# EAGLE design simhid-g1000_left (EAGLE 9.6.2)
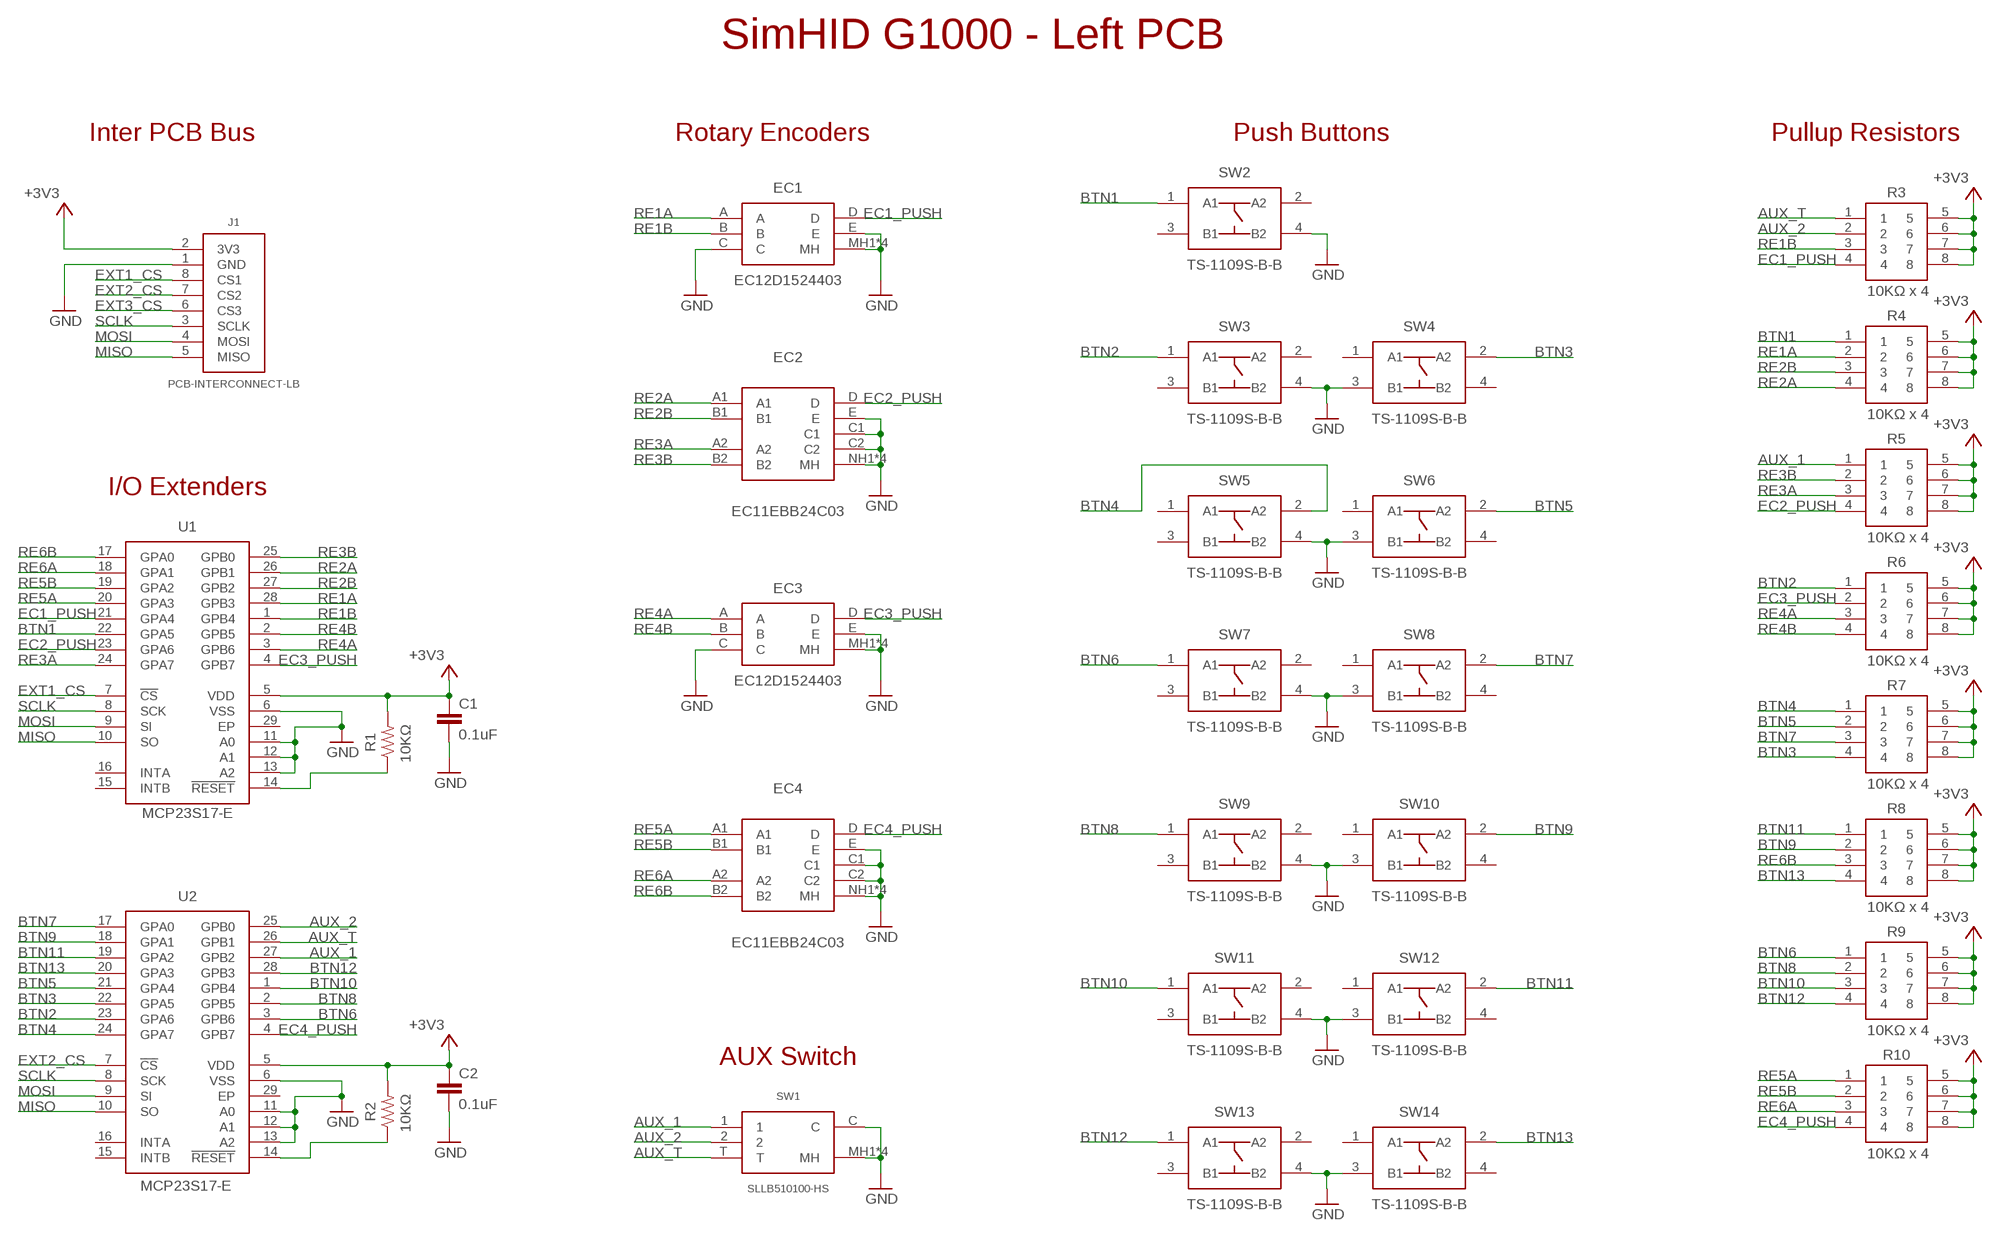
[diagram p0: schematic, sheet 1]

## Parts
C1  0.1uF  RCL_C-EUC0402-HS  [RCL_C0402_HS]
C2  0.1uF  RCL_C-EUC0402-HS  [RCL_C0402_HS]
EC1  EC12D1524403  [EC12D1524403]
EC2  EC11EBB24C03  [EC11EBB24C03]
EC3  EC12D1524403  [EC12D1524403]
EC4  EC11EBB24C03  [EC11EBB24C03]
J1  PCB-INTERCONNECT-LB  [PCB-INTERCONNECT-L]
R1  10KΩ  RCL_R-US_R0402-HS  [RCL_R0402_HS]
R2  10KΩ  RCL_R-US_R0402-HS  [RCL_R0402_HS]
R3  10KΩ x 4  BCN164A102J7  [BCN164A_1]
R4  10KΩ x 4  BCN164A102J7  [BCN164A_1]
R5  10KΩ x 4  BCN164A102J7  [BCN164A_1]
R6  10KΩ x 4  BCN164A102J7  [BCN164A_1]
R7  10KΩ x 4  BCN164A102J7  [BCN164A_1]
R8  10KΩ x 4  BCN164A102J7  [BCN164A_1]
R9  10KΩ x 4  BCN164A102J7  [BCN164A_1]
R10  10KΩ x 4  BCN164A102J7  [BCN164A_1]
SW1  SLLB510100-HS  [SLLB510100-HS]
SW2  TS-1109S-B-B  [TS-1109S-B-B]
SW3  TS-1109S-B-B  [TS-1109S-B-B]
SW4  TS-1109S-B-B  [TS-1109S-B-B]
SW5  TS-1109S-B-B  [TS-1109S-B-B]
SW6  TS-1109S-B-B  [TS-1109S-B-B]
SW7  TS-1109S-B-B  [TS-1109S-B-B]
SW8  TS-1109S-B-B  [TS-1109S-B-B]
SW9  TS-1109S-B-B  [TS-1109S-B-B]
SW10  TS-1109S-B-B  [TS-1109S-B-B]
SW11  TS-1109S-B-B  [TS-1109S-B-B]
SW12  TS-1109S-B-B  [TS-1109S-B-B]
SW13  TS-1109S-B-B  [TS-1109S-B-B]
SW14  TS-1109S-B-B  [TS-1109S-B-B]
U1  MCP23S17-E  MCP23S17-E_ML  [QFN65P600X600X100-29N]
U2  MCP23S17-E  MCP23S17-E_ML  [QFN65P600X600X100-29N]

## Nets
+3V3: C1.1 C2.1 J1.2(3V3) R1.2 R2.2 R3.5 R3.6 R3.7 R3.8 R4.5 R4.6 R4.7 R4.8 R5.5 R5.6 R5.7 R5.8 R6.5 R6.6 R6.7 R6.8 R7.5 R7.6 R7.7 R7.8 R8.5 R8.6 R8.7 R8.8 R9.5 R9.6 R9.7 R9.8 R10.5 R10.6 R10.7 R10.8 U1.5(VDD) U2.5(VDD)
AUX_1: R5.1 SW1.1 U2.27(GPB2)
AUX_2: R3.2 SW1.2 U2.25(GPB0)
AUX_T: R3.1 SW1.T U2.26(GPB1)
BTN1: R4.1 SW2.1(A1) U1.22(GPA5)
BTN2: R6.1 SW3.1(A1) U2.23(GPA6)
BTN3: R7.4 SW4.2(A2) U2.22(GPA5)
BTN4: R7.1 SW5.2(A2) U2.24(GPA7)
BTN5: R7.2 SW6.2(A2) U2.21(GPA4)
BTN6: R9.1 SW7.1(A1) U2.3(GPB6)
BTN7: R7.3 SW8.2(A2) U2.17(GPA0)
BTN8: R9.2 SW9.1(A1) U2.2(GPB5)
BTN9: R8.2 SW10.2(A2) U2.18(GPA1)
BTN10: R9.3 SW11.1(A1) U2.1(GPB4)
BTN11: R8.1 SW12.2(A2) U2.19(GPA2)
BTN12: R9.4 SW13.1(A1) U2.28(GPB3)
BTN13: R8.4 SW14.2(A2) U2.20(GPA3)
EC1_PUSH: EC1.D R3.4 U1.21(GPA4)
EC2_PUSH: EC2.D R5.4 U1.23(GPA6)
EC3_PUSH: EC3.D R6.2 U1.4(GPB7)
EC4_PUSH: EC4.D R10.4 U2.4(GPB7)
EXT1_CS: J1.8(CS1) U1.7(!CS)
EXT2_CS: J1.7(CS2) U2.7(!CS)
EXT3_CS: J1.6(CS3)
GND: C1.2 C2.2 EC1.C EC1.E EC1.MH1(MH) EC1.MH2(MH) EC1.MH3(MH) EC1.MH4(MH) EC2.C1 EC2.C2 EC2.E EC2.NH1(MH) EC2.NH2(MH) EC2.NH3(MH) EC2.NH4(MH) EC3.C EC3.E EC3.MH1(MH) EC3.MH2(MH) EC3.MH3(MH) EC3.MH4(MH) EC4.C1 EC4.C2 EC4.E EC4.NH1(MH) EC4.NH2(MH) EC4.NH3(MH) EC4.NH4(MH) J1.1(GND) SW1.C SW1.MH1(MH) SW1.MH2(MH) SW1.MH3(MH) SW1.MH4(MH) SW2.4(B2) SW3.4(B2) SW4.3(B1) SW5.4(B2) SW6.3(B1) SW7.4(B2) SW8.3(B1) SW9.4(B2) SW10.3(B1) SW11.4(B2) SW12.3(B1) SW13.4(B2) SW14.3(B1) U1.6(VSS) U1.11(A0) U1.12(A1) U1.13(A2) U2.6(VSS) U2.11(A0) U2.12(A1) U2.13(A2)
MISO: J1.5(MISO) U1.10(SO) U2.10(SO)
MOSI: J1.4(MOSI) U1.9(SI) U2.9(SI)
N$3: R1.1 U1.14(!RESET)
N$19: R2.1 U2.14(!RESET)
RE1A: EC1.A R4.2 U1.28(GPB3)
RE1B: EC1.B R3.3 U1.1(GPB4)
RE2A: EC2.A1 R4.4 U1.26(GPB1)
RE2B: EC2.B1 R4.3 U1.27(GPB2)
RE3A: EC2.A2 R5.3 U1.24(GPA7)
RE3B: EC2.B2 R5.2 U1.25(GPB0)
RE4A: EC3.A R6.3 U1.3(GPB6)
RE4B: EC3.B R6.4 U1.2(GPB5)
RE5A: EC4.A1 R10.1 U1.20(GPA3)
RE5B: EC4.B1 R10.2 U1.19(GPA2)
RE6A: EC4.A2 R10.3 U1.18(GPA1)
RE6B: EC4.B2 R8.3 U1.17(GPA0)
SCLK: J1.3(SCLK) U1.8(SCK) U2.8(SCK)
Unconnected: SW2.2(A2) SW2.3(B1) SW3.2(A2) SW3.3(B1) SW4.1(A1) SW4.4(B2) SW5.1(A1) SW5.3(B1) SW6.1(A1) SW6.4(B2) SW7.2(A2) SW7.3(B1) SW8.1(A1) SW8.4(B2) SW9.2(A2) SW9.3(B1) SW10.1(A1) SW10.4(B2) SW11.2(A2) SW11.3(B1) SW12.1(A1) SW12.4(B2) SW13.2(A2) SW13.3(B1) SW14.1(A1) SW14.4(B2) U1.15(INTB) U1.16(INTA) U1.29(EP) U2.15(INTB) U2.16(INTA) U2.29(EP)

## Notes on the sheet
- SimHID G1000 - Left PCB
- Inter PCB Bus | Rotary Encoders | Push Buttons | Pullup Resistors
- I/O Extenders
- AUX Switch

## Library data of the parts
C1 C2 = gen-discrete3:RCL_C-EU: CAPACITOR, European symbol
EC1 EC3 = RotaryEncoder:EC12D1524403
EC2 EC4 = RotaryEncoder:EC11EBB24C03
J1 = SimHID-G1000:PCB-INTERCONNECT
R1 R2 = gen-discrete3:RCL_R-US_: RESISTOR, American symbol
R3-R10 = BCN164A102J7:BCN164A102J7: BI TECHNOLOGIES / TT ELECTRONICS - BCN164A102J7 - RESISTOR, RESISTOR ARRAY, 4, 1KOHM, 5%, 1206 Source: Datasheet <http://www.farnell.com/datasheets/2158867.pdf>; ARROW_PART_NUMBER: BCN164A102J7; DESCRIPTION: BI TECHNOLOGIES / TT ELECTRONICS - BCN164A102J7 - RESISTOR, RESISTOR ARRAY, 4, 1KOHM, 5%, 1206; HEIGHT: mm; MANUFACTURER_NAME: BI Technologies; MANUFACTURER_PART_NUMBER: BCN164A102J7
SW1 = Switches:SLLB510100
SW2-SW14 = Switches:TS-1109S-B-B
U1 U2 = MCP23S17-E_ML:MCP23S17-E_ML: 16-Bit I/O Port Expander SPI 10M QFN28EP Microchip MCP23S17-E/ML, 16-channel 16bit I/O Expander 10MHz, Serial-SPI, 28-Pin QFN Source: Datasheet <http://docs-emea.rs-online.com/webdocs/1169/0900766b811692f9.pdf>; ARROW_PART_NUMBER: MCP23S17-E/ML; ARROW_PRICE-STOCK: https://www.arrow.com/en/products/mcp23s17-eml/microchip-technology; DESCRIPTION: 16-Bit I/O Port Expander SPI 10M QFN28EP Microchip MCP23S17-E/ML, 16-channel 16bit I/O Expander 10MHz, Serial-SPI, 28-Pin QFN; HEIGHT: 1mm; MANUFACTURER_NAME: Microchip; MANUFACTURER_PART_NUMBER: MCP23S17-E/ML; MOUSER_PART_NUMBER: 579-MCP23S17-E/ML; MOUSER_PRICE-STOCK: https://www.mouser.co.uk/ProductDetail/Microchip-Technology/MCP23S17-E-ML/?qs=usxtMOJb1RyqBjk32jXtPQ%3D%3D

## Board
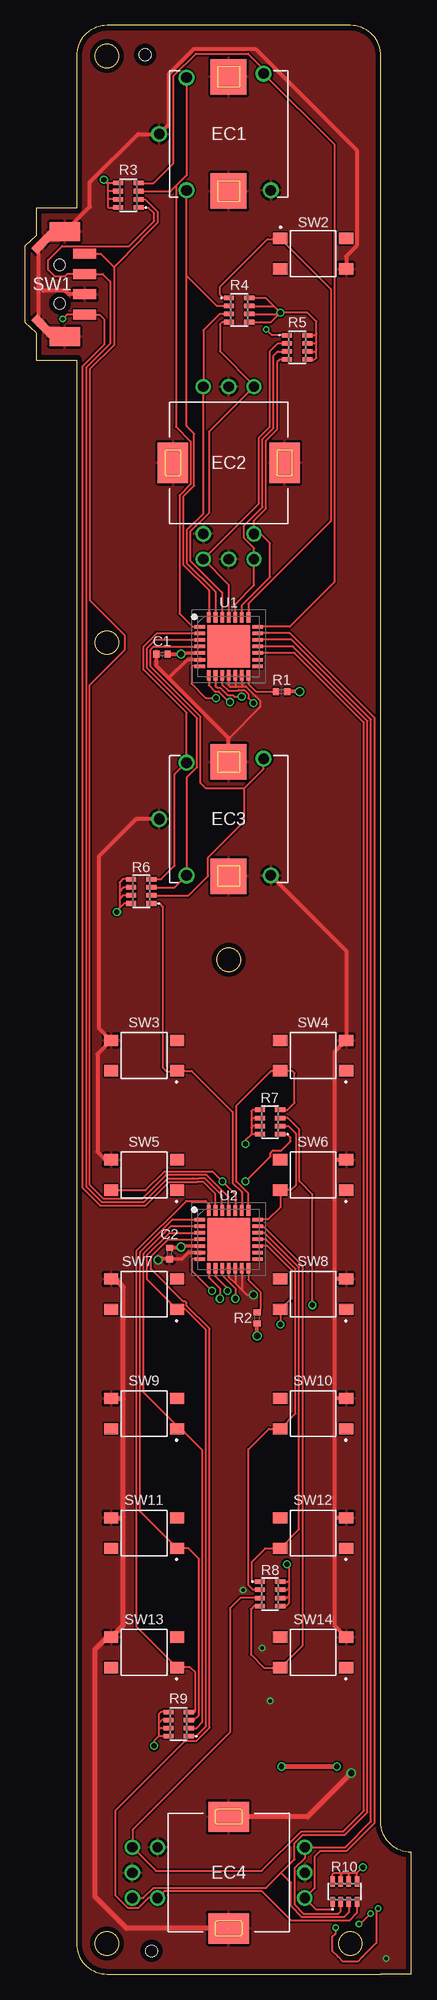
[diagram p1: board, top side]
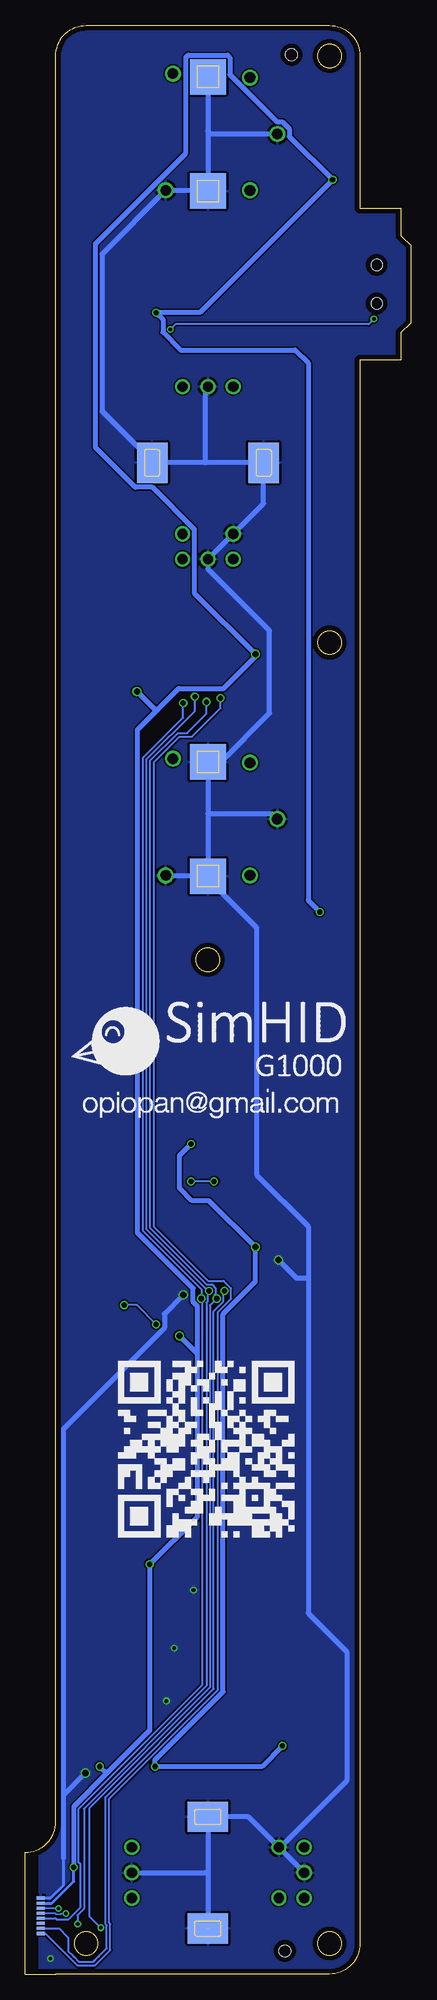
[diagram p2: board, bottom side, seen from below]

Size 38.05 x 192 mm. Coordinates in mm from the lower left corner, seen from the top.
Outline: 35.05,0 8.05,0 arc-90 5.05,3 5.05,159 1.05,159 1.05,161.7 0,162.7 0,170.3 1.05,171.3 1.05,174 5.05,174 5.05,189 arc-90 8.05,192 32.05,192 arc-90 35.05,189 35.05,15
Outline: 38.05,0 38.05,12
Outline: circle at 8.05,3 radius 1.15
Outline: circle at 8.05,131.19 radius 1.15
Outline: circle at 20.05,99.94 radius 1.15
Outline: circle at 32.05,3 radius 1.15
Outline: circle at 8.05,189 radius 1.15
Copper layers (1*16): Top 0.035mm / dielectric 1mm / Bottom 0.035mm
Design rules "Elecrow_2-layer_PCB_eagle_rule *": minimum track width 6mil, minimum drill 12mil, track to track 6mil, track to pad 6mil, pad to pad 6mil, via to via 8mil, smd to smd 0mil, copper to edge 20mil, drill to drill 10mil, minimum pad ring 6mil, minimum via ring 6mil, stop-mask expansion 0mil, vias tented up to drill 100mil, thermal gap 10mil
Holes 2.3 mm at 8.05,189 8.05,131.19 20.05,99.94 8.05,3 32.05,3
Holes 1.15 mm at 11.81,189.1 12.45,2.29

### Footprints (pad centres in the part's own frame; a part is rotated, then mirrored left to right if it is on the bottom)
RCL_C0402_HS = smd 0.6 x 0.7: 1 -0.55,0; 2 0.55,0
EC12D1524403 = drill 1.05: A 5.55,-4.15; B -5.55,-4.15; C 5.55,4.15; D -5.95,3.45; E 0,-6.85 | smd 3.5 x 3.55: MH1 -5.625,0; MH3 5.625,0 | smd 3.5 x 3.55 bottom: MH2 -5.625,0; MH4 5.625,0
EC11EBB24C03 = drill 1: A1 2.5,7.5; A2 2.5,-9.5; B1 -2.5,7.5; B2 -2.5,-9.5; C1 0,7.5; C2 0,-9.5; D 2.5,-7; E -2.5,-7 | smd 3 x 4: NH1 5.5,0; NH3 -5.5,0 | smd 3 x 4 bottom: NH2 5.5,0; NH4 -5.5,0
PCB-INTERCONNECT-L = smd 0.8 x 0.3: 1 -1.5,7.5; 2 -1.5,7; 3 -1.5,6.5; 4 -1.5,6; 5 -1.5,5.5; 6 -1.5,5; 7 -1.5,4.5; 8 -1.5,4
RCL_R0402_HS = smd 0.6 x 0.7: 1 -0.55,0; 2 0.55,0
BCN164A_1 = smd 0.45 x 1: 1 -1.2,-1; 2 -0.4,-1; 3 0.4,-1; 4 1.2,-1; 5 -1.2,1; 6 -0.4,1; 7 0.4,1; 8 1.2,1
SLLB510100-HS = smd 1 x 2.3: 1 -3,-1.45; 2 3,-1.45; C -1,-1.45; T 1,-1.45 | smd 2.6 x 0.8 rotated 45: MH1 -4.172,2.616 | smd 2.6 x 0.8 rotated 315: MH2 4.172,2.616 | smd 1.85 x 3: MH3 -5.175,0.5; MH4 5.175,0.5 | hole 1.1: 1.9,1; -1.9,1
TS-1109S-B-B = smd 1.4 x 1.1: 1 -3.25,1.5; 2 3.25,1.5; 3 -3.25,-1.5; 4 3.25,-1.5
QFN65P600X600X100-29N = smd 1.05 x 0.35: 1 -2.85,1.95; 2 -2.85,1.3; 3 -2.85,0.65; 4 -2.85,0; 5 -2.85,-0.65; 6 -2.85,-1.3; 7 -2.85,-1.95; 15 2.85,-1.95; 16 2.85,-1.3; 17 2.85,-0.65; 18 2.85,0; 19 2.85,0.65; 20 2.85,1.3; 21 2.85,1.95 | smd 0.35 x 1.05: 8 -1.95,-2.85; 9 -1.3,-2.85; 10 -0.65,-2.85; 11 0,-2.85; 12 0.65,-2.85; 13 1.3,-2.85; 14 1.95,-2.85; 22 1.95,2.85; 23 1.3,2.85; 24 0.65,2.85; 25 0,2.85; 26 -0.65,2.85; 27 -1.3,2.85; 28 -1.95,2.85 | smd 4.2 x 4.2: 29 0,0

### Placement (x,y rotation side)
C1  13.46,130.05 180 top
C2  14.22,70.99 270 top
EC1  20.05,181.3 270 top
EC2  20.05,148.9 0 top
EC3  20.05,113.8 270 top
EC4  20.05,10 270 top
J1  35.05,0 0 bottom
R1  25.27,126.36 0 top
R2  22.86,64.64 270 top
R3  10.16,175.26 90 top
R4  21.08,163.96 270 top
R5  26.8,160.27 270 top
R6  11.43,106.68 90 top
R7  24.13,83.95 90 top
R8  24.13,37.47 270 top
R9  15.11,24.64 90 top
R10  31.5,8.13 0 top
SW1  4.4,166.5 90 top
SW2  28.38,169.5 0 top
SW3  11.72,90.5 180 top
SW4  28.38,90.5 180 top
SW5  11.72,78.74 180 top
SW6  28.38,78.74 180 top
SW7  11.72,66.98 180 top
SW8  28.38,66.98 180 top
SW9  11.72,55.22 180 top
SW10  28.38,55.22 180 top
SW11  11.72,43.46 180 top
SW12  28.38,43.46 180 top
SW13  11.72,31.7 180 top
SW14  28.38,31.7 180 top
U1  20.05,130.81 0 top
U2  20.05,72.39 0 top
U$1  [SIMHID-G1000-LOGO]  33.6,83 0 bottom
U$2  [SHIMHID-G1000-QRCODE]  31.3,40.64 0 bottom

### Tracks (layer width: path | path; a pad name or v marks a point on that pad's centre or on a via)
+3V3  (via drill 0.5, 0.6)
  Top 0.2: R3.8 8.07,176.46 | 8.07,176.46 v7.75,176.78 | 8.07,176.46 8.13,176.4 8.13,175.64 | 8.13,175.64 8.13,174.88 | 8.13,174.88 8.13,174.12 8.19,174.06 R3.5 | R3.6 8.15,174.86 8.13,174.88 | R3.7 8.15,175.66 8.13,175.64 | R4.5 23.69,165.16 24.49,164.36 | 24.49,164.36 v25.15,163.7 | R4.6 24.49,164.36 | R4.7 25,163.56 v25.15,163.7 | R4.8 24.2,162.76 v25.15,163.7 | R5.5 28.5,161.47 28.7,161.67 | 28.7,161.67 28.7,162.81 27.81,163.7 v25.15,163.7 | R5.6 28.59,160.67 28.7,160.78 | 28.7,160.78 28.7,161.67 | R5.7 28.56,159.87 28.7,160.02 | 28.7,160.02 28.7,160.78 | R5.8 28.52,159.07 28.7,159.26 28.7,160.02 | R6.5 9.72,105.48 9.27,105.03 | v9.02,104.65 9.02,104.78 9.27,105.03 | R6.6 9.67,106.28 9.65,106.3 9.27,105.92 | 9.27,105.92 9.27,105.03 | R6.7 10.41,107.06 9.65,107.06 9.27,106.68 | 9.27,106.68 9.27,105.92 | R6.8 9.58,107.88 9.27,107.57 9.27,106.68 | R10.8 32.7,9.96 | 32.7,9.96 v33.27,10.54 | R10.7 31.9,9.8 32.06,9.96 | 32.06,9.96 32.7,9.96 | R10.6 31.1,9.76 31.3,9.96 | 31.3,9.96 32.06,9.96 | R10.5 30.3,9.85 30.41,9.96 31.3,9.96 | R7.5 22.3,82.75 | v21.72,81.79 21.72,82.17 22.3,82.75 | R7.6 22.46,83.55 22.3,83.38 | 22.3,83.38 22.3,82.75 | R7.7 22.5,84.35 22.3,84.14 | 22.3,84.14 22.3,83.38 | R7.8 22.41,85.15 22.3,85.03 22.3,84.14 | R8.5 25.84,38.66 26.04,38.86 | v25.78,40.39 26.04,40.13 26.04,38.86 | R8.6 25.8,37.87 26.04,38.1 | 26.04,38.1 26.04,38.86 | R8.7 25.76,37.06 26.04,37.34 | 26.04,37.34 26.04,38.1 | R8.8 25.72,36.27 26.04,36.58 26.04,37.34 | R9.5 13.15,23.44 | v12.7,22.48 12.7,22.99 13.15,23.44 | R9.6 13.35,24.24 13.34,24.26 13.15,24.07 | 13.15,24.07 13.15,23.44 | R9.7 13.48,25.04 13.15,24.71 | 13.15,24.71 13.15,24.07 | R9.8 13.39,25.84 13.15,25.6 13.15,24.71
  Top 0.35: U1.5 15.48,130.16 v15.37,130.05 | U2.5 15.48,71.74 v15.37,71.63
  Top 0.4: C1.1 v15.37,130.05 | v27.05,126.36 R1.2 | v15.37,71.63 15.28,71.54 C2.1 | v22.86,62.87 R2.2
  Top 0.5: v30.73,20.45 v25.27,20.45
  Bottom 0.3: J1.2 36.53,6.99 35.44,6.99 33.27,9.15 v33.27,10.54
  Bottom 0.5: v33.27,10.54 33.27,16.51 29.97,19.81 | 25.27,124.33 26.99,122.61 26.99,73.04 21.51,67.56 21.51,66.22 21.09,65.8 21.09,61.1 | 25.27,124.33 22.94,126.66 18.5,126.66 15.37,129.79 v15.37,130.05 21.4,136.08 21.4,142.38 25.52,146.5 27.22,146.5 31.13,150.41 31.13,170.5 22.23,179.41 22.23,188.84 21.99,189.08 18.11,189.08 17.87,188.84 17.87,187.14 13.22,182.49 12.71,182.49 12.01,181.79 12.01,181.05 v7.75,176.78 20.83,163.7 v25.15,163.7 24.48,163.04 24.48,161.75 22.75,160.02 11.43,160.02 10.16,158.75 10.16,105.79 v9.02,104.65 | v21.72,81.79 22.86,80.64 22.86,77.47 21.59,76.2 19.94,76.2 v15.37,71.63 15.37,68.22 18.55,65.04 18.55,27.82 25.27,21.1 v25.27,20.45 14.73,20.45 v12.7,22.48 | 21.09,61.1 21.09,45.07 v25.78,40.39 25.78,24 29.97,19.81 | v27.05,126.36 25.27,124.58 25.27,124.33 | v22.86,62.87 21.09,61.1 | v30.73,20.45 30.1,19.81 29.97,19.81
AUX_1  (via drill 0.35)
  Top 0.2: v3.68,163.07 4.12,163.5 SW1.1 7.32,163.5 7.75,163.07 7.75,160.53 5.66,158.44 5.66,77.44 7.37,75.73 11.85,75.73 14.16,78.04 16.51,78.04 16.95,78.04 17.57,78.04 18.75,76.86 U2.27 | R5.1 24.33,161.47 v23.75,162.05
  Bottom 0.2: v3.68,163.07 4.19,162.56 23.24,162.56 v23.75,162.05
AUX_2
  Top 0.2: SW1.2 7.41,169.5 8.73,168.18 | 8.73,168.18 8.73,160.51 6.36,158.14 6.36,135.37 9.81,131.92 9.81,130.47 6.36,127.02 6.36,77.74 7.66,76.44 11.56,76.44 13.87,78.75 17.86,78.75 20.05,76.56 U2.25 | 8.73,168.18 11.43,170.87 11.43,170.95 13.05,172.57 13.05,173.63 11.82,174.86 R3.2
AUX_T
  Top 0.2: R3.1 12.12,174.06 12.7,173.48 12.7,172.72 10.23,170.25 3.62,170.25 2.24,168.88 2.24,167.92 2.92,167.24 3.88,167.24 4.14,167.5 SW1.T 7.63,167.5 8.38,166.75 8.38,160.66 6.01,158.28 6.01,77.59 7.52,76.08 11.71,76.08 14.02,78.39 16.51,78.39 17.1,78.39 17.72,78.39 19.4,76.71 U2.26
BTN1
  Top 0.2: SW2.1 25.19,170.94 | 25.19,170.94 30.13,166 30.13,143.16 22,135.03 U1.22 | 25.19,170.94 23.88,170.94 19.18,166.24 19.18,165.48 19.5,165.16 R4.1
BTN2
  Top 0.2: R6.1 13.27,105.48 13.59,105.16 13.59,89.28 13.97,88.9 14.87,88.9 SW3.1 16.41,89 20.45,84.96 20.45,77.95 21.35,77.05 U2.23
BTN3
  Top 0.2: R7.4 25.84,85.15 26.54,85.85 26.54,88.77 26.32,89 SW4.2 24.23,89 20.8,85.57 20.8,78.1 22,76.9 U2.22
BTN4  (via drill 0.5)
  Top 0.2: v21.72,78.11 24.18,80.57 24.18,80.89 24.44,81.15 25.27,81.15 26.16,82.04 26.16,82.42 25.84,82.75 R7.1 | U2.24 20.7,76.84 19.56,77.98 v19.43,78.11 18.44,79.1 13.72,79.1 11.87,77.24 SW5.2
  Bottom 0.2: v19.43,78.11 v21.72,78.11
BTN5
  Top 0.2: R7.2 25.93,83.55 26.67,82.8 26.67,77.72 26.19,77.24 SW6.2 25.13,75.55 23.92,74.34 U2.21
BTN6
  Top 0.2: R9.1 16.17,23.5 16.89,23.5 17.82,24.43 17.82,63.46 15.8,65.48 SW7.1 12.02,68.42 12.02,70.85 14.22,73.04 U2.3
BTN7  (via drill 0.5)
  Top 0.2: v28.32,65.91 28.32,76.83 27.02,78.13 27.02,83.21 25.89,84.35 R7.3 | SW8.2 25.15,65.47 | 25.15,65.47 v25.15,64.01 | 25.15,65.47 26.29,66.61 26.29,69.34 23.89,71.74 U2.17
  Bottom 0.2: v25.15,64.01 27.05,65.91 v28.32,65.91
BTN8
  Top 0.152: SW9.1
  Top 0.2: R9.2 16.87,24.24 17.47,24.84 17.47,51.62 15.37,53.72 15.24,53.72 | 15.24,53.72 SW9.1 | U2.2 14.37,73.69 11.67,70.99 11.67,57.29 15.24,53.72
BTN9
  Top 0.2: R8.2 22.46,37.87 22,38.33 22,51.72 24,53.72 SW10.2 26.64,55.23 26.64,69.49 23.74,72.39 U2.18
BTN10
  Top 0.2: R9.3 16.66,25.04 17.12,25.5 17.12,40.92 16.08,41.96 SW11.1 11.32,45.61 11.32,71.14 14.52,74.34 U2.1
BTN11
  Top 0.2: R8.1 22.42,38.66 22.35,38.73 22.35,40.64 23.67,41.96 SW12.2 26.99,43.82 26.99,69.63 23.59,73.04 U2.19
BTN12
  Top 0.152: 14.97,30.23 SW13.1
  Top 0.2: R9.4 16.69,25.84 16.76,25.91 16.76,29.72 16.26,30.23 14.97,30.23 10.97,34.23 10.97,71.29 15.88,76.2 17.78,76.2 18.1,75.88 U2.28
BTN13
  Top 0.2: R8.4 22.55,36.27 22.23,35.94 22.23,31.5 23.52,30.2 SW14.2 27.35,32.41 27.35,69.78 23.44,73.69 U2.20
EC1_PUSH
  Top 0.2: R3.4 12.63,176.46 14.61,178.44 14.61,187.03 16.81,189.23 21.97,189.23 23.5,187.7 EC1.D 30.48,180.27 30.48,137.16 26.08,132.76 U1.21
EC2_PUSH
  Top 0.2: R5.4 25.09,159.07 24.82,158.81 24.82,152.18 23.75,151.1 23.75,144.4 22.55,143.2 EC2.D 23.2,141.9 24.13,140.97 24.13,137.66 21.35,134.88 U1.23
EC3_PUSH
  Top 0.2: 21.59,116.84 17.78,116.84 17.29,117.33 17.29,123.89 12.36,128.82 12.36,130.5 12.67,130.81 U1.4 | EC3.D 23.5,118.75 21.59,116.84 | R6.2 16.11,106.28 18.02,108.19 18.02,110.03 21.59,113.6 21.59,116.84
EC4_PUSH
  Top 0.2: R10.4 32.7,6.03 31.93,5.26 26.23,5.26 23.35,8.15 13.7,8.15 EC4.D 12.13,7.5 11.13,6.5 10.13,6.5 8.89,7.74 8.89,16.13 15.72,22.96 16.86,22.96 18.17,24.28 18.17,63.6 15.92,65.86 15.92,66.14 15.77,66.28 15.56,66.28 12.38,69.46 12.38,70.7 14.06,72.39 U2.4
EXT1_CS  (via drill 0.5)
  Top 0.2: U1.7 16.46,128.86 16.38,128.78 16.38,127.13 17.78,125.73 v18.8,125.73
  Bottom 0.2: v18.8,125.73 18.8,124.71 21.59,121.92 22.86,121.92 25.4,119.38 25.4,73.66 20.06,68.32 18.5,68.32 17.76,67.58 17.76,66.54 19.05,65.25 19.05,28.03 29.79,17.29 29.79,5.07 29.68,4.96 29.68,2.37 31.15,0.89 32.95,0.89 36.06,4 J1.8
EXT2_CS  (via drill 0.5)
  Top 0.2: U2.7 16.46,70.44 16.38,70.36 16.38,69.34 v18.41,67.31
  Bottom 0.2: v18.41,67.31 18.52,67.2 18.52,66.28 19.49,65.31 19.49,28.09 30.14,17.44 30.14,4.92 30.03,4.81 30.03,2.54 30.75,1.81 30.8,1.75 30.86,1.7 31.2,1.36 31.32,1.24 32.78,1.24 33.24,1.7 33.3,1.75 33.35,1.81 33.81,2.27 33.81,3.58 34.73,4.5 J1.7
GND  (via drill 0.35, 0.6)  (1 unrouted)
  Top 0.2: SW1.MH2 2.82,171.7 3.56,171.7 3.74,171.52 SW1.MH4 2.77,171.68 1.27,170.18 | U1.11 20.05,127.02 20.2,126.86 20.7,126.86 | 20.7,126.86 21.34,126.86 | 21.34,126.86 21.76,126.86 23.13,125.49 23.13,124.82 20.07,121.75 | U1.12 20.7,126.86 | U1.13 21.35,126.88 21.34,126.86 | U2.11 20.05,68.71 20.7,68.06 | v22.48,66.93 21.83,66.93 21.35,67.41 | U2.12 20.7,68.06 | 20.7,68.06 21.35,67.41 | U2.13 21.35,67.41
  Top 0.35: U1.6 15.97,129.51 14.14,127.68 | U2.6 16.1,71.09 15.45,70.44 C2.2
  Top 0.4: SW1.MH4 6.35,174.12 6.35,176.53 11.12,181.3 EC1.E 14.15,182.25 14.15,187.21 16.62,189.68 22.68,189.68 32.69,179.68 32.69,170.3 31.63,169.25 SW2.4 | SW1.C 4.28,165.5 3.92,165.86 1.78,165.86 1.27,166.37 | 1.27,170.18 1.27,166.37 | 1.27,166.37 1.27,162.56 2.5,161.32 SW1.MH3 2.79,161.32 SW1.MH1 | EC3.E 10.93,113.8 7.24,110.11 7.24,93.23 SW3.4 7.11,90.64 7.11,81.03 7.9,80.24 SW5.4 | EC3.C 31.63,100.82 SW4.3 30.48,90.85 30.48,80.14 | SW14.3 30.48,34.35 30.48,45.09 | 30.48,80.14 30.48,68.45 | 30.48,68.45 30.48,56.64 | 30.48,56.64 30.48,45.09 | SW12.3 30.61,44.96 30.48,45.09 | SW10.3 30.56,56.72 30.48,56.64 | SW8.3 30.51,68.48 30.48,68.45 | SW6.3 30.58,80.24 30.48,80.14 | C1.2 12.91,128.91 14.14,127.68 20.07,121.75 20.05,121.73 EC3.MH2 20.07,119.44 | C2.2 13.17,70.44 v13.08,70.36
  Top 0.5: EC4.NH2 9.98,4.5 6.86,7.62 6.86,32 8.05,33.2 SW13.4 9.65,34.38 9.65,45.09 | 9.65,45.09 9.65,56.64 | 9.65,56.64 9.65,67.69 8.86,68.48 SW7.4 | SW9.4 9.57,56.72 9.65,56.64 | SW11.4 9.53,44.96 9.65,45.09 | v32.13,19.81 27.82,15.5 EC4.NH4
  Bottom 0.3: J1.1 35.56,7.5 34.29,8.77 34.29,11.43
  Bottom 0.5: EC1.MH2 20.05,181.61 | 20.05,181.61 EC1.MH4 20.12,175.75 EC1.C 30.48,169.47 30.48,153.98 25.4,148.9 | 20.05,181.61 19.74,181.3 EC1.E | 20.32,148.9 EC2.NH4 14.55,144.9 EC2.E EC2.C2 20.05,138.43 13.97,132.35 13.97,124.24 18.78,119.43 EC3.MH2 20.05,114.3 | 20.32,148.9 25.4,148.9 | 25.4,148.9 EC2.NH2 | EC2.C1 20.32,156.13 20.32,148.9 | 20.05,114.3 EC3.MH4 20.32,108.18 | EC3.E 13.7,114.3 20.05,114.3 | 20.32,108.18 24.12,108.18 EC3.C | 20.05,10.16 EC4.NH4 16.05,15.5 EC4.E | 20.05,10.16 EC4.NH2 | EC4.C1 20.21,10 20.05,10.16 | EC4.C2 EC4.E | EC4.E 12.9,12.5 6.35,19.05 6.35,31.75 10.16,35.56 10.16,68.58 | 20.32,108.18 15.24,103.1 15.24,78.74 10.16,73.66 10.16,68.58 | v22.48,66.93 24.34,65.07 24.34,63.67 34.29,53.73 34.29,17.65 | 34.29,11.43 34.29,17.65 | v13.08,70.36 11.3,68.58 10.16,68.58 | v32.13,19.81 34.29,17.65
  other vias: 35.56,1.52 24.13,26.92 23.37,32.13 21.46,37.85
  pour Top: -1.27,193.04 39.37,193.04 39.37,-1.27 -1.27,-1.27
  pour Bottom: -2.54,195.58 36.7,195.58 36.7,-3.81 -2.54,-3.81
MISO  (via drill 0.5)
  Top 0.2: U1.10 19.4,127.05 20.01,126.44 20.99,126.44 21.07,126.51 21.61,126.51 21.99,126.13 21.99,125.71 v22.48,125.22 | U2.10 19.4,68.86 20.7,67.56 v20.7,66.55
  Bottom 0.2: v22.48,125.22 22.48,123.8 26.49,119.79 26.49,73.25 20.7,67.47 v20.7,66.55 20.59,66.44 20.59,28.48 32.77,16.3 32.77,10.96 32.62,10.81 32.62,6.57 33.8,5.39 34.96,5.39 35.07,5.5 J1.5
MOSI  (via drill 0.35, 0.5)
  Top 0.2: U1.9 18.75,126.92 18.93,126.74 19.21,126.74 19.95,126 20.46,126 20.61,125.86 v21.34,125.86 | U2.9 18.75,68.75 19.94,67.56 v19.94,67.31 | v34.04,5.97 33.02,4.95 v32.89,4.95
  Bottom 0.152: J1.4 35.11,6 35.03,5.92 34.57,5.92 34.52,5.97 v34.04,5.97
  Bottom 0.2: v21.34,125.86 21.34,124.44 26.13,119.64 26.13,73.4 20.05,67.31 v19.94,67.31 20.05,67.2 20.05,66.28 20.19,66.13 20.19,28.38 32.27,16.31 32.27,6.42 32.89,5.79 v32.89,4.95
N$3
  Top 0.2: U1.14 22,127.12 22.76,126.36 R1.1
N$19
  Top 0.2: U2.14 22,68.41 23.18,67.22 23.18,65.52 R2.1
RE1A
  Top 0.2: 15.9,167.36 15.9,152.53 16.66,151.77 16.66,146.65 15.55,145.55 15.55,138.89 18.1,136.34 U1.28 | 15.9,167.36 EC1.A | R4.2 18.9,164.36 15.9,167.36
RE1B
  Top 0.2: EC1.B 15.9,177.22 14.86,176.18 | 14.86,176.18 14.86,152.45 16.3,151.01 16.3,146.8 15.2,145.69 15.2,134.03 16.46,132.76 U1.1 | R3.3 14.34,175.66 14.86,176.18
RE2A
  Top 0.2: R4.4 19.37,162.76 19.18,162.56 19.18,159.89 22.61,156.46 EC2.A1 18.11,151.96 18.11,143.96 16.26,142.11 16.26,139.28 19.4,136.13 U1.26
RE2B
  Top 0.2: R4.3 19.16,163.56 17.55,161.95 EC2.B1 17.55,143.91 15.9,142.26 15.9,139.04 18.75,136.19 U1.27
RE3A
  Top 0.2: R5.3 24.87,159.87 24.47,159.47 24.47,152.32 23.4,151.25 23.4,144.54 21.55,142.7 21.55,141.49 22.55,140.48 EC2.A2 22.55,136.85 20.7,135 U1.24
RE3B
  Top 0.2: R5.2 24.91,160.67 24.12,159.88 24.12,152.47 23.04,151.39 23.04,144.9 EC2.B2 20.05,136.9 U1.25
RE4A
  Top 0.2: R6.3 14.73,107.08 EC3.A 15.9,117.88 16.94,118.92 16.94,123.74 12.01,128.67 12.01,130.65 12.82,131.46 U1.3
RE4B
  Top 0.2: R6.4 13.39,107.88 14.73,109.22 14.73,118.21 15.9,119.38 EC3.B 15.9,124.28 11.65,128.53 11.65,130.79 12.97,132.11 U1.2
RE5A
  Top 0.2: R10.1 30.3,6.42 30.23,6.35 28.7,6.35 EC4.A1 28.55,8.5 28.55,11.62 29.08,12.15 31.7,12.15 34.44,14.89 34.44,123.75 26.09,132.11 U1.20
RE5B
  Top 0.2: R10.2 31.1,6.2 30.86,5.97 27.43,5.97 26.54,6.86 26.54,8 26.55,8.01 26.55,10.41 27.55,11.42 EC4.B1 31.55,12.5 34.09,15.04 34.09,123.61 26.24,131.46 U1.19
RE6A
  Top 0.2: EC4.A2 11.63,7.5 12.63,8.5 23.74,8.5 25.21,9.97 | 25.21,9.97 26.55,11.31 26.55,12.91 27.35,13.72 31.5,13.72 33.74,15.96 33.74,123.46 26.39,130.81 U1.18 | R10.3 31.9,6.12 31.4,5.62 27.29,5.62 26.19,6.71 26.19,8.99 25.21,9.97
RE6B
  Top 0.2: EC4.B2 10.57,12.48 | 10.57,12.48 12.89,10.16 23.29,10.16 27.2,14.07 31.35,14.07 33.38,16.1 33.38,123.32 26.54,130.16 U1.17 | R8.3 21.19,37.06 20.16,36.04 20.16,23.8 10.57,14.21 10.57,12.48
SCLK  (via drill 0.35, 0.5)
  Top 0.2: U1.8 18.1,127 18.71,126.39 19.07,126.39 20.1,125.35 v20.19,125.35 | U2.8 18.1,68.64 19.18,67.56 v19.18,66.55 | v34.8,6.48 34.62,6.29 34.62,3.08 33.35,1.81 33.3,1.75 33.24,1.7 32.78,1.24 31.32,1.24 30.86,1.7 30.8,1.75 30.75,1.81 30.29,2.27 30.29,3.73 30.61,4.04 v30.61,4.57
  Bottom 0.152: J1.3 36.53,6.48 v34.8,6.48
  Bottom 0.2: v20.19,125.35 20.19,124.18 22.1,122.27 23.01,122.27 25.78,119.5 25.78,73.54 20.2,67.97 19.67,67.97 19.28,67.58 19.28,67.04 19.37,66.95 19.37,66.36 | 19.37,66.36 19.84,65.88 19.84,28.24 31.75,16.33 31.75,5.71 v30.61,4.57 | 19.37,66.36 v19.18,66.55